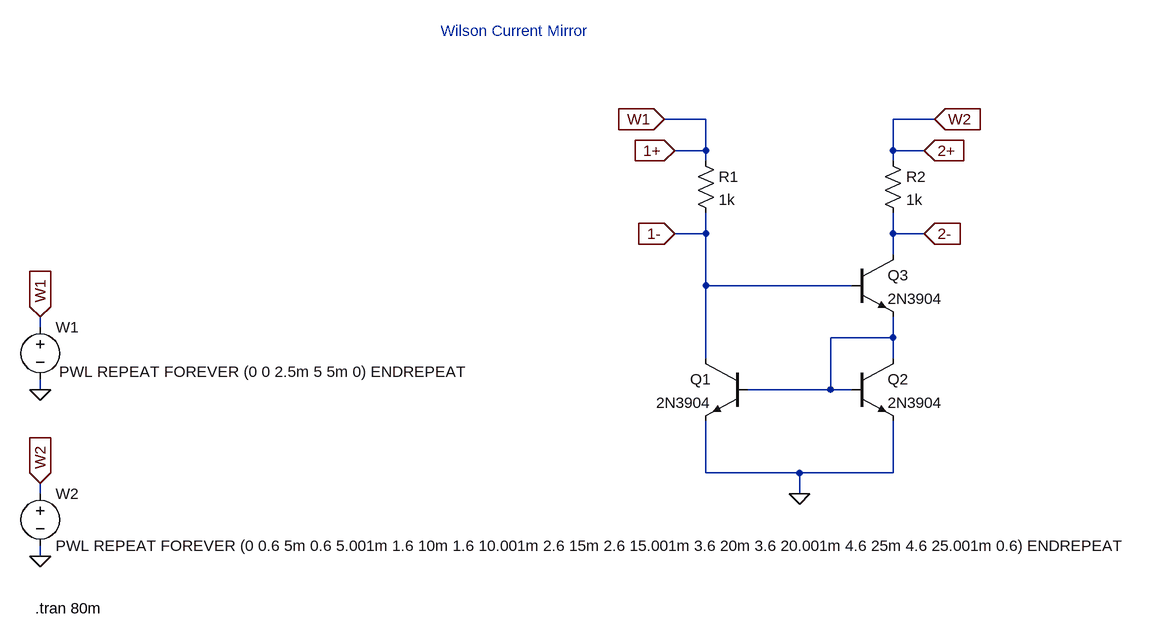
[diagram p0: schematic wilson_current_mirror.asc]
wilson_current_mirror.asc, the LTspice schematic file:
Version 4
SHEET 1 2016 1044
WIRE -208 -64 -272 -64
WIRE 144 -64 80 -64
WIRE -208 -16 -208 -64
WIRE -208 -16 -256 -16
WIRE 80 -16 80 -64
WIRE 128 -16 80 -16
WIRE -208 0 -208 -16
WIRE 80 0 80 -16
WIRE -208 112 -208 80
WIRE -208 112 -256 112
WIRE 80 112 80 80
WIRE 128 112 80 112
WIRE 80 144 80 112
WIRE -208 192 -208 112
WIRE 16 192 -208 192
WIRE -1232 256 -1232 240
WIRE 80 272 80 240
WIRE 80 272 -16 272
WIRE -208 304 -208 192
WIRE 80 304 80 272
WIRE -1232 352 -1232 336
WIRE -16 352 -16 272
WIRE -16 352 -144 352
WIRE 16 352 -16 352
WIRE -208 480 -208 400
WIRE -64 480 -208 480
WIRE 80 480 80 400
WIRE 80 480 -64 480
WIRE -1232 512 -1232 496
WIRE -64 512 -64 480
WIRE -1232 608 -1232 592
FLAG -1232 352 0
FLAG -1232 608 0
FLAG -1232 240 W1
IOPIN -1232 240 In
FLAG -1232 496 W2
IOPIN -1232 496 In
FLAG -64 512 0
FLAG -272 -64 W1
IOPIN -272 -64 In
FLAG 144 -64 W2
IOPIN 144 -64 In
FLAG -256 -16 1+
IOPIN -256 -16 In
FLAG -256 112 1-
IOPIN -256 112 In
FLAG 128 -16 2+
IOPIN 128 -16 In
FLAG 128 112 2-
IOPIN 128 112 In
SYMBOL voltage -1232 240 R0
WINDOW 3 29 84 Left 2
WINDOW 123 0 0 Left 0
WINDOW 39 0 0 Left 0
SYMATTR Value PWL REPEAT FOREVER (0 0 2.5m 5 5m 0) ENDREPEAT
SYMATTR InstName W1
SYMBOL voltage -1232 496 R0
WINDOW 123 0 0 Left 0
WINDOW 39 0 0 Left 0
SYMATTR InstName W2
SYMATTR Value PWL REPEAT FOREVER (0 0.6 5m 0.6 5.001m 1.6 10m 1.6 10.001m 2.6 15m 2.6 15.001m 3.6 20m 3.6 20.001m 4.6 25m 4.6 25.001m 0.6) ENDREPEAT
SYMBOL res -224 -16 R0
SYMATTR InstName R1
SYMATTR Value 1k
SYMBOL res 64 -16 R0
SYMATTR InstName R2
SYMATTR Value 1k
SYMBOL npn -144 304 M0
SYMATTR InstName Q1
SYMATTR Value 2N3904
SYMBOL npn 16 304 R0
SYMATTR InstName Q2
SYMATTR Value 2N3904
SYMBOL npn 16 144 R0
SYMATTR InstName Q3
SYMATTR Value 2N3904
TEXT -616 -200 Left 2 ;Wilson Current Mirror
TEXT -1240 688 Left 2 !.tran 80m

The netlist it stands for:
* wilson_current_mirror.asc
V§W1 1+ 0 PWL REPEAT FOREVER (0 0 2.5m 5 5m 0) ENDREPEAT
V§W2 2+ 0 PWL REPEAT FOREVER (0 0.6 5m 0.6 5.001m 1.6 10m 1.6 10.001m 2.6 15m 2.6 15.001m 3.6 20m 3.6 20.001m 4.6 25m 4.6 25.001m 0.6) ENDREPEAT
R1 1+ 1- 1k
R2 2+ 2- 1k
Q1 1- N001 0 0 2N3904
Q2 N001 N001 0 0 2N3904
Q3 2- 1- N001 0 2N3904
.model NPN NPN
.model PNP PNP
.lib standard.bjt
* Wilson Current Mirror
.tran 80m
.backanno
.end